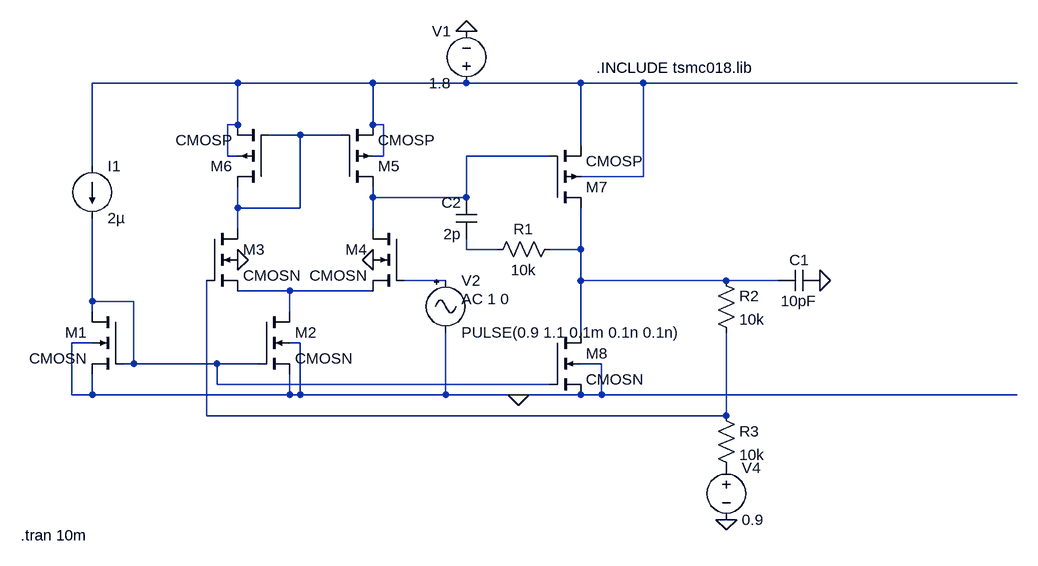
[diagram p0: schematic closed loop (1).asc]
closed loop (1).asc, the LTspice schematic file:
Version 4
SHEET 1 880 680
WIRE -512 -448 -736 -448
WIRE -304 -448 -512 -448
WIRE -160 -448 -304 -448
WIRE 16 -448 -160 -448
WIRE 112 -448 16 -448
WIRE 688 -448 112 -448
WIRE -512 -384 -512 -448
WIRE -512 -384 -528 -384
WIRE -304 -384 -304 -448
WIRE -288 -384 -304 -384
WIRE -416 -368 -464 -368
WIRE -352 -368 -416 -368
WIRE 16 -352 16 -448
WIRE -528 -336 -528 -384
WIRE -512 -336 -528 -336
WIRE -288 -336 -288 -384
WIRE -288 -336 -304 -336
WIRE -32 -336 -160 -336
WIRE -736 -320 -736 -448
WIRE 112 -304 112 -448
WIRE 112 -304 16 -304
WIRE -304 -272 -304 -288
WIRE -160 -272 -160 -336
WIRE -160 -272 -304 -272
WIRE -512 -256 -512 -288
WIRE -416 -256 -416 -368
WIRE -416 -256 -512 -256
WIRE -512 -224 -512 -256
WIRE -304 -224 -304 -272
WIRE -160 -192 -160 -208
WIRE -112 -192 -160 -192
WIRE 16 -192 16 -256
WIRE 16 -192 -32 -192
WIRE -192 -144 -256 -144
WIRE 16 -144 16 -192
WIRE 240 -144 16 -144
WIRE 320 -144 240 -144
WIRE -432 -128 -512 -128
WIRE -304 -128 -432 -128
WIRE -736 -112 -736 -240
WIRE -672 -112 -736 -112
WIRE -736 -96 -736 -112
WIRE -432 -96 -432 -128
WIRE 16 -64 16 -144
WIRE -736 -48 -768 -48
WIRE -416 -48 -432 -48
WIRE -672 -16 -672 -112
WIRE -672 -16 -688 -16
WIRE -544 -16 -672 -16
WIRE -480 -16 -544 -16
WIRE 48 -16 16 -16
WIRE -544 16 -544 -16
WIRE -32 16 -544 16
WIRE -768 32 -768 -48
WIRE -736 32 -736 0
WIRE -736 32 -768 32
WIRE -432 32 -432 0
WIRE -432 32 -736 32
WIRE -416 32 -416 -48
WIRE -416 32 -432 32
WIRE -192 32 -192 -64
WIRE -192 32 -416 32
WIRE -80 32 -192 32
WIRE 16 32 -80 32
WIRE 48 32 48 -16
WIRE 48 32 16 32
WIRE 688 32 48 32
WIRE -560 64 -560 -144
WIRE 240 64 240 -64
WIRE 240 64 -560 64
FLAG -160 -528 0
FLAG -304 -176 0
FLAG -512 -176 0
FLAG -80 32 0
FLAG 240 224 0
FLAG 384 -144 0
SYMBOL cmosn -688 -96 M0
SYMATTR InstName M1
SYMATTR Value2 l=1u w=2u
SYMBOL current -736 -320 R0
WINDOW 123 0 0 Left 2
WINDOW 39 0 0 Left 2
SYMATTR InstName I1
SYMATTR Value 2µ
SYMBOL cmosn -480 -96 R0
SYMATTR InstName M2
SYMATTR Value2 l=1u w=20u
SYMBOL cmosn -560 -224 R0
SYMATTR InstName M3
SYMATTR Value2 l=1u w=2.1739u
SYMBOL cmosn -256 -224 M0
SYMATTR InstName M4
SYMATTR Value2 l=1u w=2.1739u
SYMBOL cmosp -352 -288 M180
SYMATTR InstName M5
SYMATTR Value2 l=1u w=1.189u
SYMBOL cmosp -464 -288 R180
SYMATTR InstName M6
SYMATTR Value2 l=1u w=1.189u
SYMBOL voltage -160 -432 R180
WINDOW 0 24 96 Left 2
WINDOW 3 24 16 Left 2
WINDOW 123 0 0 Left 2
WINDOW 39 0 0 Left 2
SYMATTR InstName V1
SYMATTR Value 1.8
SYMBOL cmosp -32 -256 M180
SYMATTR InstName M7
SYMATTR Value2 l=1u w=11.89u
SYMBOL cmosn -32 -64 R0
SYMATTR InstName M8
SYMATTR Value2 l=1u w=100u
SYMBOL res 224 -160 R0
SYMATTR InstName R2
SYMATTR Value 10k
SYMBOL res 224 48 R0
SYMATTR InstName R3
SYMATTR Value 10k
SYMBOL voltage 240 128 R0
WINDOW 123 0 0 Left 2
WINDOW 39 0 0 Left 2
SYMATTR InstName V4
SYMATTR Value 0.9
SYMBOL Misc\\signal -192 -160 R0
WINDOW 123 24 44 Left 2
WINDOW 39 0 0 Left 2
SYMATTR Value2 AC 1 0
SYMATTR InstName V2
SYMATTR Value PULSE(0.9 1.1 0.1m 0.1n 0.1n)
SYMBOL cap 384 -160 R90
WINDOW 0 0 32 VBottom 2
WINDOW 3 32 32 VTop 2
SYMATTR InstName C1
SYMATTR Value 10pF
SYMBOL cap -144 -208 R180
WINDOW 0 24 56 Left 2
WINDOW 3 24 8 Left 2
SYMATTR InstName C2
SYMATTR Value 2p
SYMBOL res -16 -208 R90
WINDOW 0 0 56 VBottom 2
WINDOW 3 32 56 VTop 2
SYMATTR InstName R1
SYMATTR Value 10k
TEXT 40 -472 Left 2 !.INCLUDE tsmc018.lib
TEXT -846 248 Left 2 !.tran 10m

The netlist it stands for:
* closed loop (1).asc
M1 N008 N008 0 0 CMOSN l=1u w=2u
I1 N001 N008 2µ
M2 N007 N008 0 0 CMOSN l=1u w=20u
M3 N002 N009 N007 0 CMOSN l=1u w=2.1739u
M4 N003 N006 N007 0 CMOSN l=1u w=2.1739u
M5 N003 N002 N001 N001 CMOSP l=1u w=1.189u
M6 N002 N002 N001 N001 CMOSP l=1u w=1.189u
V1 N001 0 1.8
M7 N005 N003 N001 N001 CMOSP l=1u w=11.89u
M8 N005 N008 0 0 CMOSN l=1u w=100u
R2 N005 N009 10k
R3 N009 P001 10k
V4 P001 0 0.9
V2 N006 0 PULSE(0.9 1.1 0.1m 0.1n 0.1n) AC 1 0
C1 0 N005 10pF
C2 N004 N003 2p
R1 N005 N004 10k
.model NMOS NMOS
.model PMOS PMOS
.lib standard.mos
.INCLUDE tsmc018.lib
.tran 10m
.backanno
.end